# EAGLE design fabkit_modif (EAGLE 7.2.0)
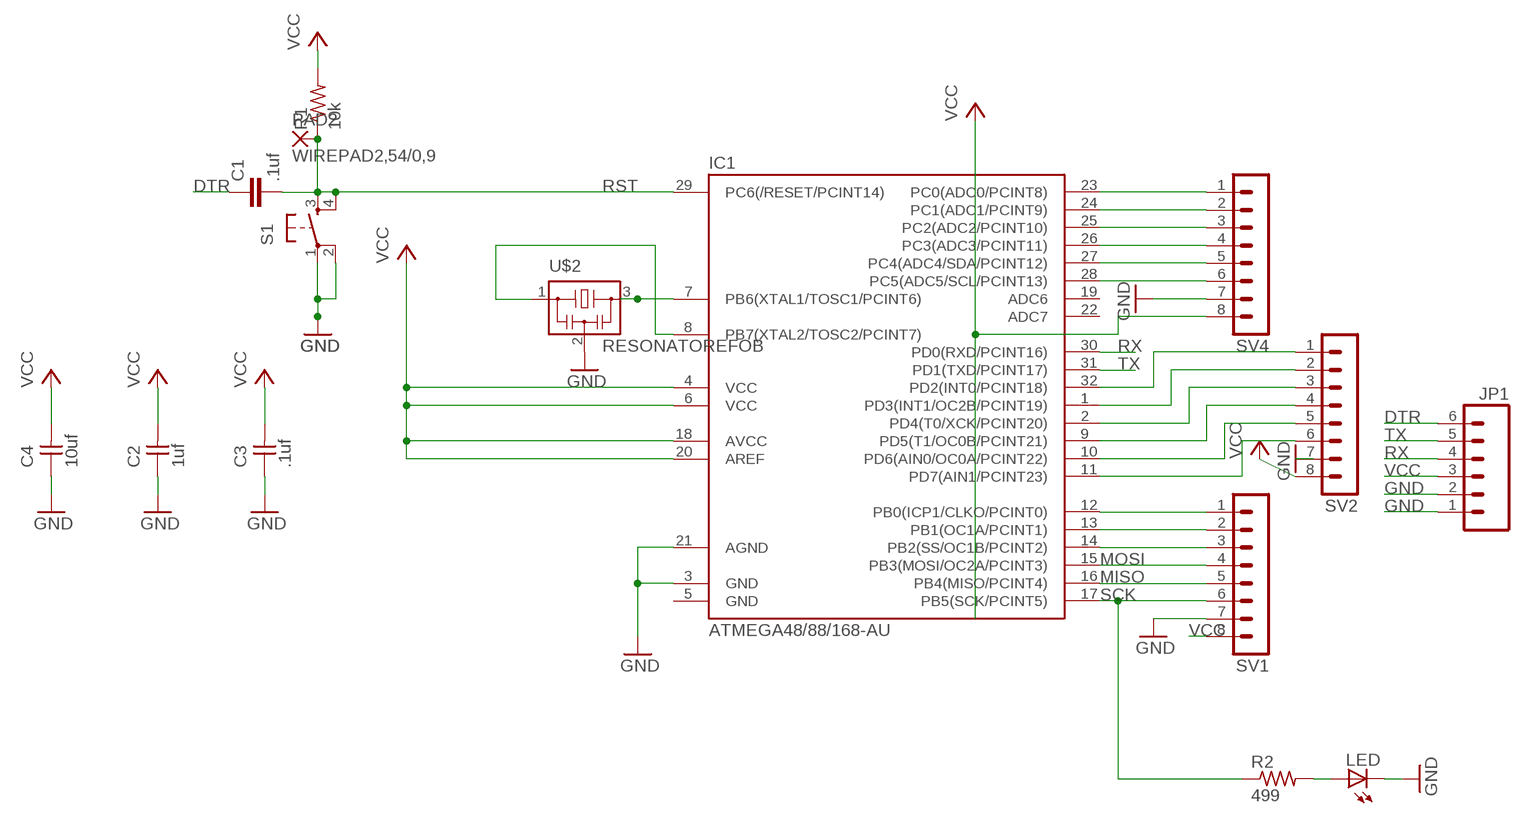
[diagram p0: schematic, sheet 1]

## Parts
C1  .1uf  C-EUC1206  [C1206]
C2  1uf  UNPOLARIZED_CAPACITOR1206  [1206]
C3  .1uf  UNPOLARIZED_CAPACITOR1206  [1206]
C4  10uf  UNPOLARIZED_CAPACITOR1206  [1206]
IC1  ATMEGA48/88/168-AU  [TQFP32-08]
JP1  M06SMD  [1X06-SMD]
LED  LED1206  [1206]
PAD2  WIREPAD2,54/0,9  [2,54/0,9]
R1  10k  RESISTOR1206  [1206]
R2  499  RESISTOR1206  [1206]
S1  6MM_SWITCH6MM_SWITCH  [6MM_SWITCH]
SV1  MA08-1  [MA08-1]
SV2  MA08-1  [MA08-1]
SV4  MA08-1  [MA08-1]
U$2  RESONATOREFOB  [EFOBM]

## Nets
DTR: C1.1 JP1.6
GND: C2.1 C3.1 C4.1 IC1.3(GND) IC1.21(AGND) JP1.1 JP1.2 LED.2(C) S1.1(P) S1.2(P1) SV1.7 SV2.7 SV4.7 U$2.2
MISO: IC1.16(PB4(MISO/PCINT4)) SV1.5
MOSI: IC1.15(PB3(MOSI/OC2A/PCINT3)) SV1.4
N$1: IC1.8(PB7(XTAL2/TOSC2/PCINT7)) U$2.1
N$2: IC1.12(PB0(ICP1/CLKO/PCINT0)) SV1.1
N$3: IC1.23(PC0(ADC0/PCINT8)) SV4.1
N$4: IC1.24(PC1(ADC1/PCINT9)) SV4.2
N$5: IC1.25(PC2(ADC2/PCINT10)) SV4.3
N$6: IC1.26(PC3(ADC3/PCINT11)) SV4.4
N$7: IC1.27(PC4(ADC4/SDA/PCINT12)) SV4.5
N$8: IC1.28(PC5(ADC5/SCL/PCINT13)) SV4.6
N$9: IC1.7(PB6(XTAL1/TOSC1/PCINT6)) U$2.3
N$10: IC1.32(PD2(INT0/PCINT18)) SV2.1
N$11: IC1.1(PD3(INT1/OC2B/PCINT19)) SV2.2
N$12: IC1.2(PD4(T0/XCK/PCINT20)) SV2.3
N$13: IC1.9(PD5(T1/OC0B/PCINT21)) SV2.4
N$14: IC1.10(PD6(AIN0/OC0A/PCINT22)) SV2.5
N$15: IC1.11(PD7(AIN1/PCINT23)) SV2.6
N$17: IC1.13(PB1(OC1A/PCINT1)) SV1.2
N$18: IC1.14(PB2(SS/OC1B/PCINT2)) SV1.3
N$23: LED.1(A) R2.2
RST: C1.2 IC1.29(PC6(/RESET/PCINT14)) PAD2.1(P) R1.1 S1.3(S) S1.4(S1)
RX: IC1.30(PD0(RXD/PCINT16)) JP1.4
SCK: IC1.17(PB5(SCK/PCINT5)) R2.1 SV1.6
TX: IC1.31(PD1(TXD/PCINT17)) JP1.5
VCC: C2.2 C3.2 C4.2 IC1.4(VCC) IC1.6(VCC) IC1.18(AVCC) IC1.20(AREF) JP1.3 R1.2 SV1.8 SV2.8 SV4.8
Unconnected: IC1.19(ADC6) IC1.22(ADC7)

## Power pins joined to a net without a drawn wire
GND: IC1.5(GND)

## Library data of the parts
C1 = rcl:C-EU: CAPACITOR, European symbol
C2-C4 = ng:UNPOLARIZED_CAPACITOR: unpolarized_capacitor
IC1 = atmega8:ATMEGA48/88/168
JP1 = SparkFun:M06: Header 6 Standard 6-pin 0.1" header. Use with straight break away headers (SKU : PRT-00116), right angle break away headers (PRT-00553), swiss pins (PRT-00743), machine pins (PRT-00117), and female headers (PRT-00115). Molex polarized connector foot print use with SKU : PRT-08094 with associated crimp pins and housings. NOTES ON THE VARIANTS LOCK and LOCK_LONGPADS... This footprint was designed to help hold the alignment of a through-hole component (i.e. 6-pin header) while soldering it into place. You may notice that each hole has been shifted either up or down by 0.005 of an inch from it's more standard position (which is a perfectly straight line). This slight alteration caused the pins (the squares in the middle) to touch the edges of the holes. Because they are alternating, it causes a "brace" to hold the component in place. 0.005 has proven to be the perfect amount of "off-center" position when using our standard breakaway headers. Although looks a little odd when you look at the bare footprint, once you have a header in there, the alteration is very hard to notice. Also, if you push a header all the way into place, it is covered up entirely on the bottom side. This idea of altering the position of holes to aid alignment will be further integrated into the Sparkfun Library for other footprints. It can help hold any component with 3 or more connection pins.
LED = ng:LED
PAD2 = wirepad:WIREPAD: Wire PAD connect wire on PCB
R1 R2 = ng:RESISTOR
S1 = ng:6MM_SWITCH: OMRON SWITCH
SV1 SV2 SV4 = con-lstb:MA08-1: PIN HEADER
U$2 = fab:RESONATOR

## Board
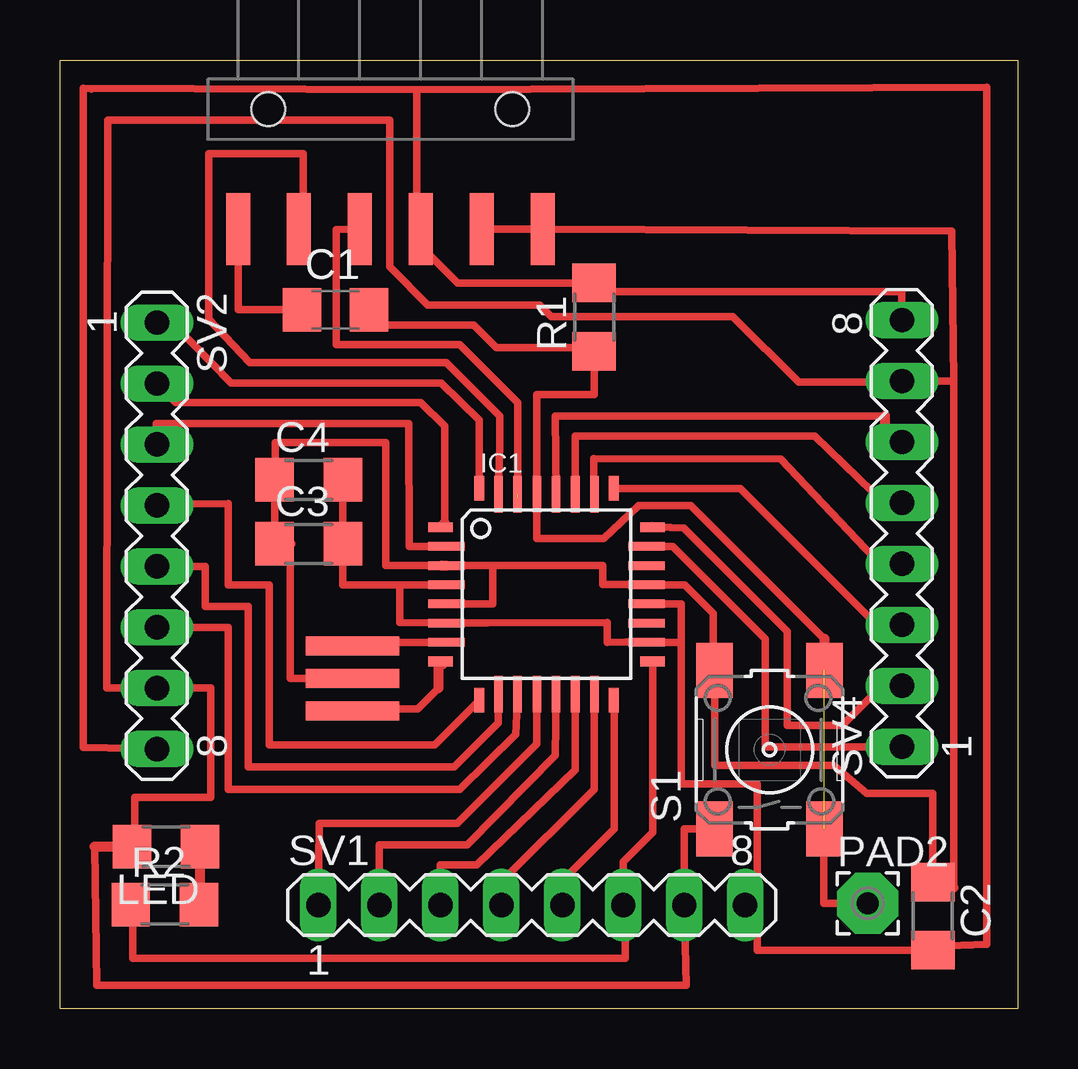
[diagram p1: board, top side]

Size 39.9 x 39.55 mm. Coordinates in mm from the lower left corner, seen from the top.
Outline: 0,39.55 39.9,39.55 39.9,0 0,0 0,39.55
Copper layers (1*16): Top 0.035mm / dielectric 1.5mm / Bottom 0.035mm
Design rules "default *": minimum track width 10mil, minimum drill 24mil, track to track 16mil, track to pad 16mil, pad to pad 16mil, via to via 16mil, smd to smd 16mil, copper to edge 16mil, drill to drill 8mil, minimum pad ring 10mil, minimum via ring 8mil, stop-mask expansion 4mil, vias tented up to drill 0mil, thermal gap 10mil

### Footprints (pad centres in the part's own frame; a part is rotated, then mirrored left to right if it is on the bottom)
C1206 = smd 1.6 x 1.8: 1 -1.4,0; 2 1.4,0
1206 = smd 1.6 x 1.803: 1 -1.422,0; 2 1.422,0
TQFP32-08 = smd 1.016 x 0.406: 1 -4.42,2.8; 8 -4.42,-2.8; 17 4.42,-2.8; 24 4.42,2.8 | smd 1.524 x 0.356: 2 -4.166,2; 3 -4.166,1.2; 4 -4.166,0.4; 5 -4.166,-0.4; 6 -4.166,-1.2; 7 -4.166,-2; 18 4.166,-2; 19 4.166,-1.2; 20 4.166,-0.4; 21 4.166,0.4; 22 4.166,1.2; 23 4.166,2 | smd 0.406 x 1.016: 9 -2.8,-4.42; 16 2.8,-4.42; 25 2.8,4.42; 32 -2.8,4.42 | smd 0.356 x 1.524: 10 -2,-4.166; 11 -1.2,-4.166; 12 -0.4,-4.166; 13 0.4,-4.166; 14 1.2,-4.166; 15 2,-4.166; 26 2,4.166; 27 1.2,4.166; 28 0.4,4.166; 29 -0.4,4.166; 30 -1.2,4.166; 31 -2,4.166
1X06-SMD = smd 1 x 3: 1 -6.35,5; 2 -3.81,5; 3 -1.27,5; 4 1.27,5; 5 3.81,5; 6 6.35,5 | hole 1.4: -5.08,0; 5.08,0
2,54/0,9 = drill 0.914 pad 2.54 octagon: 1 0,0
6MM_SWITCH = smd 2.286 x 1.524: 1 -3.302,2.286; 2 3.302,2.286; 3 -3.302,-2.286; 4 3.302,-2.286
MA08-1 = drill 1.016 long: 1 -8.89,0; 2 -6.35,0; 3 -3.81,0; 4 -1.27,0; 5 1.27,0; 6 3.81,0; 7 6.35,0; 8 8.89,0
EFOBM = smd 0.8 x 3.9: 1 -1.35,0; 2 0,0; 3 1.35,0

### Placement (x,y rotation side)
C1  11.48,29.13 0 top
C2  36.37,3.86 270 top
C3  10.36,19.38 0 top
C4  10.36,22.05 0 top
IC1  20.27,17.27 0 top
JP1  13.77,37.49 180 top
LED  4.42,6.76 180 top
PAD2  33.66,4.39 0 top
R1  22.25,28.83 90 top
R2  4.37,4.34 0 top
S1  29.57,10.79 90 top
SV1  19.66,4.32 0 top
SV2  4.04,19.71 270 top
SV4  35.08,19.81 90 top
U$2  12.19,13.77 90 top

### Tracks (layer width: path | path; a pad name or v marks a point on that pad's centre or on a via)
DTR
  Top 0.305: JP1.6 7.42,29.13 C1.1
GND
  Top 0.305: IC1.21 24.33,17.67 | IC1.21 26.04,17.67 27.23,16.48 27.23,13.51 | 1.45,6.76 1.52,0.96 26.09,0.96 SV1.7 26.01,7.49 S1.1 | JP1.2 JP1.1 37.16,32.41 37.24,26.16 | 15.9,18.47 18.03,18.47 | 18.03,18.47 22.61,18.47 22.61,17.68 23.62,17.68 IC1.21 | IC1.5 18.03,16.87 18.03,18.47 | C2.1 36.37,8.97 33.6,8.97 32.23,10.13 27.28,10.13 S1.2 | 37.24,5.05 37.24,26.16 | SV4.7 37.24,26.16 | 35.03,26.11 30.79,26.11 28.04,28.85 20.47,28.85 19.99,29.34 15.32,29.34 13.79,30.86 13.74,30.94 13.74,37.03 1.98,37.03 1.96,13.36 SV2.7 6.27,13.36 6.27,8.81 3.12,8.81 3.12,6.88 | IC1.3 13.56,18.47 13.56,23.6 8.97,23.6 8.97,22.07 | C3.1 C4.1 | 9.6,19.38 9.6,13.77 U$2.2
  Top 0.356: 24.33,17.67 24.33,17.68
  Top 0.406: 15.9,18.47 15.88,18.47 | 15.9,18.47 | 15.9,18.47 15.93,18.47 | 15.93,18.47 IC1.3 | 15.93,18.47 | S1.2 27.23,13.51 | C2.1 36.27,5.05 37.24,5.05 | 1.45,6.76 LED.2 3.12,6.88 | 35.03,26.11 SV4.7 | C4.1 8.97,22.07 | C3.1 9.6,19.38
MISO
  Top 0.305: 20.93,5.33 23.09,7.49 23.09,12.83
  Top 0.406: SV1.5 20.93,5.33 | 23.09,12.83 IC1.16
MOSI
  Top 0.305: 18.39,5.28 22.25,9.14 22.25,11.23 IC1.15
  Top 0.406: SV1.4 18.39,5.28
N$1
  Top 0.305: 15.77,13.36 14.91,12.49 12.19,12.49
  Top 0.406: 15.95,14.37 IC1.8 15.77,14.4 15.77,13.36 | U$2.1 12.19,12.49
N$2
  Top 0.305: SV1.1 10.79,7.72 16.56,7.72 19.87,11.03 IC1.12
N$3
  Top 0.305: IC1.23 25.53,19.27 29.39,15.42 29.39,10.92 SV4.1
N$4
  Top 0.305: IC1.24 25.46,20.07 25.98,20.04 30.3,15.72 30.3,11.81 32.59,11.81 34.19,13.41
  Top 0.406: IC1.24 24.64,20.07 | 34.19,13.41 35.03,13.41 SV4.2
N$5
  Top 0.305: IC1.25 28.35,21.69 34.06,15.98
  Top 0.406: 34.06,15.98 35.05,15.98 SV4.3
N$6
  Top 0.305: 22.25,21.44 IC1.26 22.24,22.94 30.02,22.91 34.27,18.44
  Top 0.406: 34.27,18.44 34.98,18.44 SV4.4
N$7
  Top 0.305: IC1.27 21.47,23.88 31.45,23.88 34.47,20.95
  Top 0.406: 34.47,20.95 34.95,20.95 SV4.5
N$8
  Top 0.305: IC1.28 20.64,24.71 34.37,24.71
  Top 0.406: 34.37,24.71 34.39,23.62 SV4.6
N$9
  Top 0.305: IC1.7 12.35,15.27
  Top 0.406: 12.35,15.27 arc90 U$2.3
N$10
  Top 0.305: IC1.32 17.47,24.54 15.88,26.09 7.14,26.09 4.67,28.6
  Top 0.406: SV2.1 4.67,28.6
N$11
  Top 0.305: SV2.2 4.83,25.27 15.04,25.27 16.03,24.28 16.03,20.25
  Top 0.406: 16.03,20.25 IC1.1
N$12
  Top 0.305: SV2.3 4.01,24.38 14.53,24.38 14.55,19.27 IC1.2
N$13
  Top 0.305: 4.04,21.03 7.01,21.06 7.01,17.65 8.71,17.65 8.71,11 15.62,11 IC1.9
  Top 0.406: 17.47,12.64 IC1.9 | 4.04,21.03 SV2.4
N$14
  Top 0.305: SV2.5 6.04,18.44 6.04,16.76 7.85,16.76 7.85,10.08 16.43,10.08 18.26,11.91 18.26,12.24 IC1.10
N$15
  Top 0.305: IC1.11 18.99,11.42 16.66,9.14 7.01,9.14 7.01,15.9 SV2.6
N$17
  Top 0.305: SV1.2 13.31,6.83 16.97,6.83 20.64,10.56 IC1.13
N$18
  Top 0.305: SV1.3 15.85,5.99 17.37,5.99 21.47,9.96 IC1.14
N$23
  Top 0.406: R2.2 5.97,4.34 5.84,4.47 LED.1
RST  (1 unrouted)
  Top 0.305: 22.1,27.56 18.19,27.56 17.25,28.5 13.52,28.5 | 31.83,7.49 31.83,4.39 PAD2.1 | R1.1 22.25,25.61 19.87,25.61 IC1.29 19.87,19.61 22.66,19.61 24.11,20.98 26.29,20.98 31.85,15.42
  Top 0.406: 22.1,27.56 R1.1 | S1.3 31.83,7.49 | 13.52,28.5 C1.2 | 31.85,15.42 S1.4
RX  (1 unrouted)
  Top 0: 11.46,27.69 11.51,27.69
  Top 0.305: 19.07,21.34 19.07,25.27 16.66,27.69 11.51,27.69 11.51,32.47 JP1.4
  Top 0.406: JP1.4 12.65,32.9 12.5,32.28 12.62,32.77 12.52,32.61 12.52,32.29
SCK
  Top 0.305: 3.02,3.63 3.02,2.11 23.55,2.11 23.55,4.32 SV1.6 23.47,6.12 24.69,7.34 IC1.17
  Top 0.406: 3.02,3.63 R2.1
TX
  Top 0.305: 10.13,32.59 10.13,35.64 6.2,35.64 6.2,28.75 7.9,26.92 16.1,26.92 18.31,24.71 18.31,23.51 IC1.31
  Top 0.406: 10.13,32.59 JP1.5
VCC
  Top 0.254: 21.64,30.18 21.79,30.05 R1.2 | 14.86,32.69 JP1.3 15.19,32.69 | 1.32,38.3 0.96,38.38
  Top 0.305: IC1.20 25.88,16.87 25.88,15.27 | IC1.4 14.15,17.67 | 14.15,17.67 14.15,16.1 17.8,16.08 | 17.8,16.08 IC1.6 | 17.8,16.08 22.81,16.1 22.81,15.27 23.6,15.29 IC1.18 25.88,15.27 | 25.88,15.27 25.88,9.37 29.06,9.37 29.06,4.27 29.06,2.44 C2.2 | 36.45,2.59 38.61,2.69 38.61,38.41 14.86,38.3 | SV2.8 0.96,10.9 0.96,38.38 14.86,38.3 | R1.2 16.57,30.25 15.01,31.8 | 14.86,32.69 14.86,38.3 | 22.61,29.9 35.08,29.9 SV4.8 | 14.15,17.67 11.79,17.67 C3.2 C4.2
  Top 0.406: 15.14,32.52 JP1.3 15.02,31.98 15.01,31.8 | 21.77,30.2 21.64,30.18 21.61,30.2 | R1.2 22.61,29.9 | 36.45,2.59 C2.2 | 29.06,4.27 28.55,4.27 SV1.8